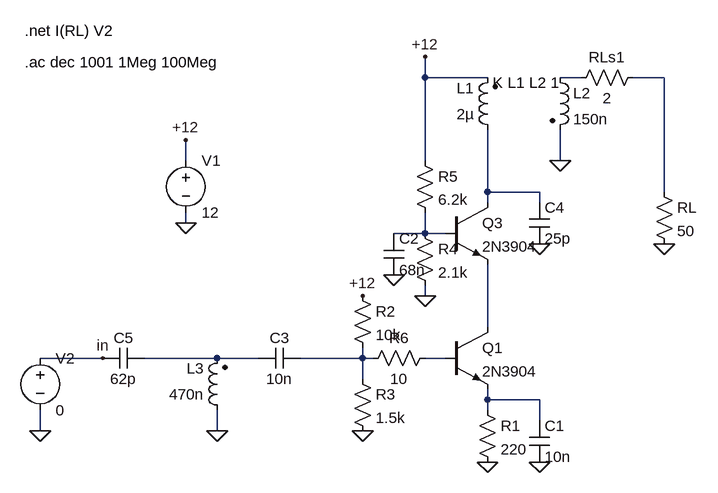
[diagram p0: schematic 21M.asc]
21M.asc, the LTspice schematic file:
Version 4
SHEET 1 880 680
WIRE 160 -32 160 -64
WIRE 256 -32 160 -32
WIRE 400 -32 368 -32
WIRE 528 -32 480 -32
WIRE -208 96 -208 64
WIRE 160 96 160 -32
WIRE 368 96 368 48
WIRE 256 144 256 48
WIRE 336 144 256 144
WIRE 528 144 528 -32
WIRE 256 160 256 144
WIRE 336 160 336 144
WIRE -208 192 -208 176
WIRE 160 208 160 176
WIRE 160 208 112 208
WIRE 192 208 160 208
WIRE 160 304 160 288
WIRE 256 352 256 256
WIRE -336 400 -432 400
WIRE -160 400 -272 400
WIRE -96 400 -160 400
WIRE 64 400 64 384
WIRE 64 400 -32 400
WIRE 80 400 64 400
WIRE 192 400 160 400
WIRE 64 432 64 400
WIRE 256 464 256 448
WIRE 336 464 256 464
WIRE 256 480 256 464
WIRE 336 496 336 464
WIRE -432 512 -432 480
WIRE -160 512 -160 480
FLAG 256 560 0
FLAG 336 560 0
FLAG 64 512 0
FLAG -208 192 0
FLAG -208 64 +12
FLAG 64 304 +12
FLAG 160 -64 +12
FLAG 160 304 0
FLAG 112 272 0
FLAG -432 512 0
FLAG 528 224 0
FLAG 336 224 0
FLAG -336 400 in
FLAG 368 96 0
FLAG -160 512 0
DATAFLAG 256 320 "$"
DATAFLAG 176 400 "$"
DATAFLAG 112 208 "$"
SYMBOL npn 192 352 R0
SYMATTR InstName Q1
SYMATTR Value 2N3904
SYMBOL npn 192 160 R0
SYMATTR InstName Q3
SYMATTR Value 2N3904
SYMBOL res 240 464 R0
SYMATTR InstName R1
SYMATTR Value 220
SYMBOL cap 320 496 R0
SYMATTR InstName C1
SYMATTR Value 10n
SYMBOL cap 96 208 R0
SYMATTR InstName C2
SYMATTR Value 68n
SYMBOL cap -32 384 R90
WINDOW 0 0 32 VBottom 2
WINDOW 3 32 32 VTop 2
SYMATTR InstName C3
SYMATTR Value 10n
SYMBOL voltage -208 80 R0
SYMATTR InstName V1
SYMATTR Value 12
SYMBOL voltage -432 384 R0
SYMATTR InstName V2
SYMATTR Value 0
SYMATTR Value2 AC 1
SYMATTR SpiceLine Rser=50
SYMBOL res 48 288 R0
SYMATTR InstName R2
SYMATTR Value 10k
SYMBOL res 48 416 R0
SYMATTR InstName R3
SYMATTR Value 1.5k
SYMBOL res 144 192 R0
SYMATTR InstName R4
SYMATTR Value 2.1k
SYMBOL res 144 80 R0
SYMATTR InstName R5
SYMATTR Value 6.2k
SYMBOL ind2 272 64 R180
WINDOW 0 36 80 Left 2
WINDOW 3 36 40 Left 2
SYMATTR InstName L1
SYMATTR Value 2µ
SYMATTR Type ind
SYMATTR SpiceLine Rser=12
SYMBOL cap 320 160 R0
SYMATTR InstName C4
SYMATTR Value 25p
SYMBOL res 512 128 R0
SYMATTR InstName RL
SYMATTR Value 50
SYMBOL ind2 352 -48 R0
SYMATTR InstName L2
SYMATTR Value 150n
SYMATTR Type ind
SYMBOL ind2 -144 496 R180
WINDOW 0 36 80 Left 2
WINDOW 3 36 40 Left 2
SYMATTR InstName L3
SYMATTR Value 470n
SYMATTR Type ind
SYMBOL cap -272 384 R90
WINDOW 0 0 32 VBottom 2
WINDOW 3 32 32 VTop 2
SYMATTR InstName C5
SYMATTR Value 62p
SYMBOL res 176 384 R90
WINDOW 0 0 56 VBottom 2
WINDOW 3 32 56 VTop 2
SYMATTR InstName R6
SYMATTR Value 10
SYMBOL res 496 -48 R90
WINDOW 0 0 56 VBottom 2
WINDOW 3 32 56 VTop 2
SYMATTR InstName RLs1
SYMATTR Value 2
TEXT -456 -56 Left 2 !.ac dec 1001 1Meg 100Meg
TEXT -456 -104 Left 2 !.net I(RL) V2
TEXT 264 -24 Left 2 !K L1 L2 1

The netlist it stands for:
* 21M.asc
Q1 N005 N008 N009 0 2N3904
Q3 N003 N004 N005 0 2N3904
R1 N009 0 220
C1 N009 0 10n
C2 N004 0 68n
C3 N007 N006 10n
V1 +12 0 12
V2 in 0 0 AC 1 Rser=50
R2 +12 N007 10k
R3 N007 0 1.5k
R4 N004 0 2.1k
R5 +12 N004 6.2k
L1 N003 +12 2µ Rser=12
C4 N003 0 25p
RL N002 0 50
L2 N001 0 150n
L3 0 N006 470n
C5 N006 in 62p
R6 N008 N007 10
RLs1 N002 N001 2
.model NPN NPN
.model PNP PNP
.lib standard.bjt
.ac dec 1001 1Meg 100Meg
.net I(RL) V2
K L1 L2 1
.backanno
.end